# EAGLE design encoder (EAGLE 5.11)
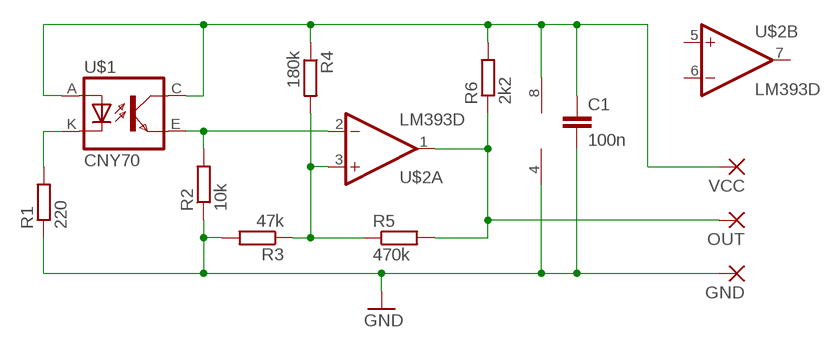
[diagram p0: schematic, sheet 1]

## Parts
C1  100n  C-EUC1206  [C1206]
GND  SMD5  [SMD2,54-5,08]
OUT  SMD5  [SMD2,54-5,08]
R1  220  R-EU_M1206  [M1206]
R2  10k  R-EU_M1206  [M1206]
R3  47k  R-EU_M1206  [M1206]
R4  180k  R-EU_M1206  [M1206]
R5  470k  R-EU_M1206  [M1206]
R6  2k2  R-EU_M1206  [M1206]
U$1  CNY70  [4]
U$2  LM393D  [SO08]
VCC  SMD5  [SMD2,54-5,08]

## Nets
GND: C1.2 GND.1(P) R1.1 R2.1 R3.2 U$2.4(P:V-)
N$3: R3.1 R4.2 R5.1 U$2.3(A:+IN)
N$5: OUT.1(P) R5.2 R6.1 U$2.1(A:OUT)
N$6: R2.2 U$1.E(EMI) U$2.2(A:-IN)
N$7: R1.2 U$1.K(C)
N$8: C1.1 R4.1 R6.2 U$1.A U$1.C(COL) U$2.8(P:V+) VCC.1(P)
Unconnected: U$2.5(B:+IN) U$2.6(B:-IN) U$2.7(B:OUT)

## Library data of the parts
C1 = rcl:C-EU: CAPACITOR, European symbol
GND OUT VCC = wirepad:SMD5: SMD PAD
R1-R6 = rcl:R-EU_: RESISTOR, European symbol
U$1 = robot:CNY70
U$2 = linear:LM393: COMPARATOR

## Board
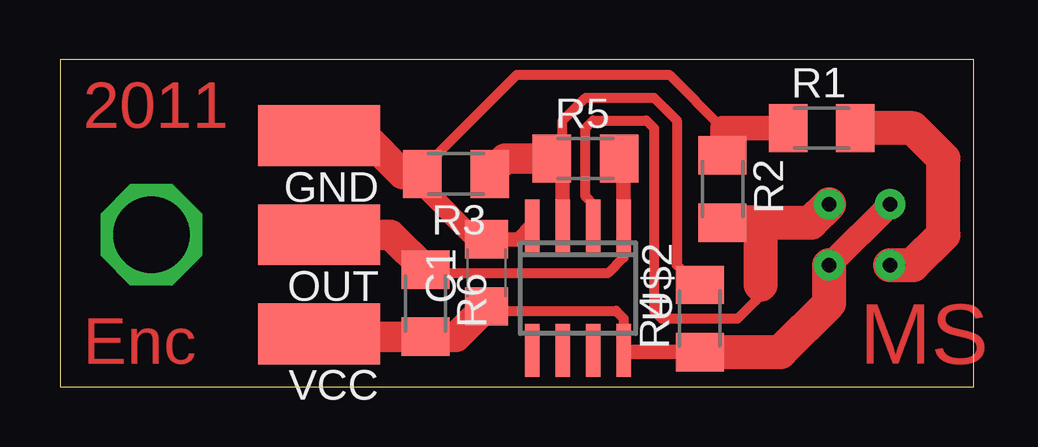
[diagram p1: board, top side]
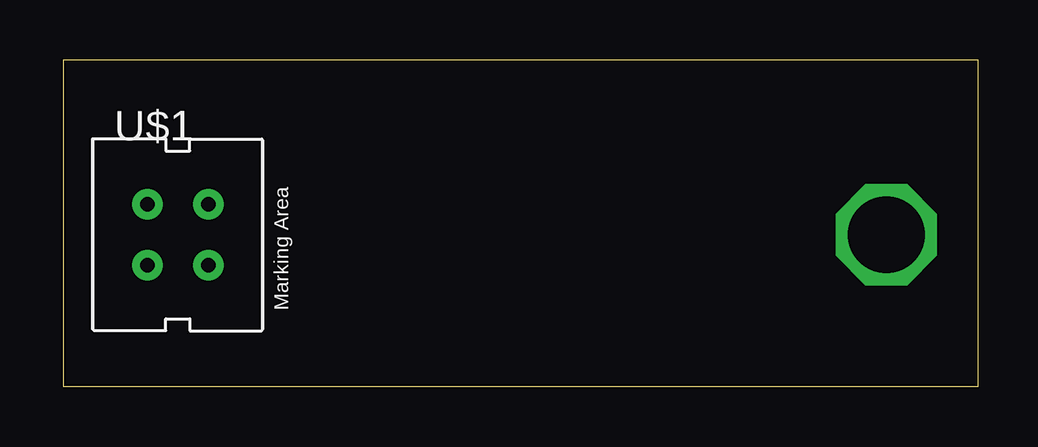
[diagram p2: board, bottom side, seen from below]

Size 38.09 x 13.64 mm. Coordinates in mm from the lower left corner, seen from the top.
Outline: 0,0 38.09,0 38.09,13.64 0,13.64 0,0
Copper layers (1*16): Top 0.035mm / dielectric 1.5mm / Bottom 0.035mm
Design rules "default": minimum track width 10mil, minimum drill 24mil, track to track 8mil, track to pad 8mil, pad to pad 8mil, via to via 8mil, smd to smd 8mil, copper to edge 40mil, drill to drill 8mil, minimum pad ring 10mil, minimum via ring 8mil, stop-mask expansion 4mil, vias tented up to drill 0mil, thermal gap 10mil

### Footprints (pad centres in the part's own frame; a part is rotated, then mirrored left to right if it is on the bottom)
C1206 = smd 1.6 x 1.8: 1 -1.4,0; 2 1.4,0
SMD2,54-5,08 = smd 2.54 x 5.08: 1 0,0
M1206 = smd 1.6 x 2: 1 -1.4,0; 2 1.4,0
4 = drill 0.61 pad 1.27 round: A -1.27,1.27; C 1.27,-1.27; E 1.27,1.27; K -1.27,-1.27
SO08 = smd 0.6 x 2.2: 1 -1.905,-2.6; 2 -0.635,-2.6; 3 0.635,-2.6; 4 1.905,-2.6; 5 1.905,2.6; 6 0.635,2.6; 7 -0.635,2.6; 8 -1.905,2.6

### Placement (x,y rotation side)
C1  17.78,4.76 90 top
GND  10.79,10.48 90 top
OUT  10.79,6.35 90 top
R1  31.75,10.79 0 top
R2  27.62,8.26 270 top
R3  16.51,8.89 180 top
R4  26.67,2.86 90 top
R5  21.91,9.53 0 top
R6  15.24,3.49 270 top
U$1  33.34,6.35 0 bottom
U$2  21.59,4.13 180 top
VCC  10.79,2.22 90 top

### Tracks (layer width: path | path; a pad name or v marks a point on that pad's centre or on a via)
GND
  Top 0.406: 27.62,10.79 25.4,13.02 19.05,13.02 15.56,9.53 15.56,9.34 R3.2
  Top 0.61: C1.2 19.12,6.16 U$2.4
  Top 0.813: C1.2 17.33,6.16 15.24,8.26 15.24,8.76 R3.2
  Top 1.016: R1.1 27.62,10.79 R2.1
  Top 1.27: GND.1 12.7,10.48 14.29,8.89 R3.2
N$1  (via drill 3.2)
  other vias: 3.81,6.35
N$3
  Top 0.406: R4.2 26.54,4.26 25.72,5.08 25.72,11.11 24.77,12.06 21.91,12.06 20.95,11.11 20.95,9.97 R5.1
  Top 0.61: U$2.3 20.95,9.39 R5.1
  Top 1.27: R5.1 18.54,9.53 R3.1
N$5
  Top 0.406: R6.1 15.75,4.89 15.88,4.76 22.86,4.76 23.5,5.4 U$2.1
  Top 0.61: U$2.1 23.5,9.39 R5.2
  Top 1.27: OUT.1 13.78,6.35 R6.1
N$6
  Top 0.406: U$2.2 22.23,7.62 21.91,7.94 21.91,10.79 22.23,11.11 24.45,11.11 24.77,10.79 24.77,3.17 25.08,2.86 28.26,2.86 29.21,3.81 29.21,4.26 29.4,5.08
  Top 1.422: 29.21,6.86 R2.2 | 29.21,6.86 31.3,6.86 U$1.E | 29.21,4.26 29.21,6.86
N$7
  Top 1.422: U$1.K 35.56,5.08 36.83,6.35 36.83,9.53 35.56,10.79 R1.2
N$8
  Top 0.406: U$2.8 23.5,2.86 23.18,3.17 17.97,3.17 C1.1
  Top 0.61: R4.1 23.62,1.46 23.5,1.27 U$2.8
  Top 1.016: U$1.C U$1.A
  Top 1.27: C1.1 16.51,2.09 R6.2 10.79,2.09 VCC.1
  Top 1.422: R4.1 30.03,1.46 32.07,3.49 U$1.C

### Text on the board
Top: 2011 | Enc | MS